# EAGLE design relay-set-d-decode (EAGLE 7.3.0)
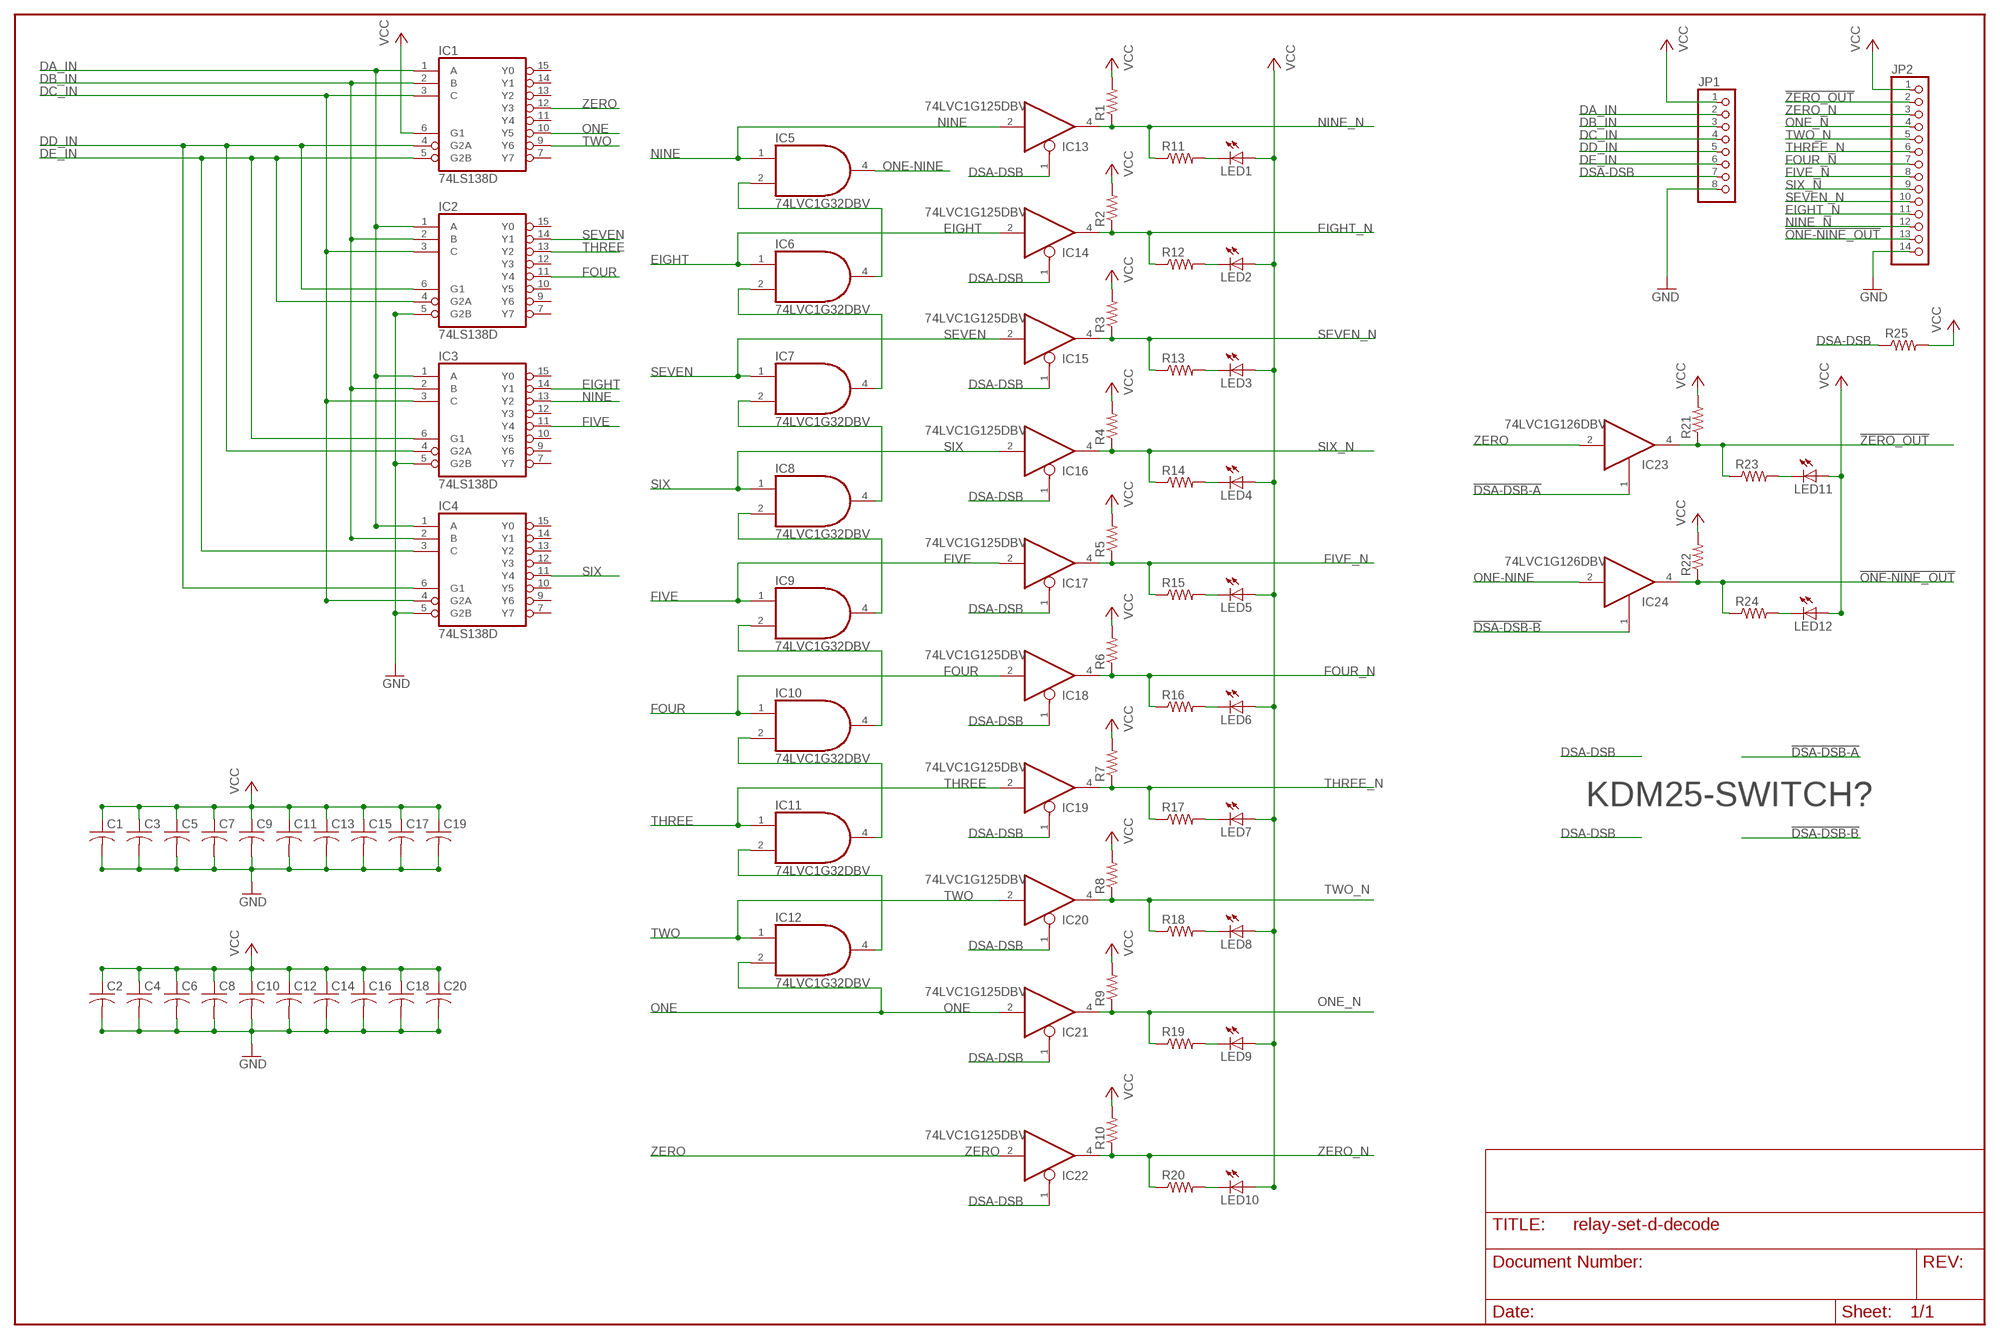
[diagram p0: schematic, sheet 1]

## Parts
C1  C-USC0805  [C0805]
C2  C-USC0805  [C0805]
C3  C-USC0805  [C0805]
C4  C-USC0805  [C0805]
C5  C-USC0805  [C0805]
C6  C-USC0805  [C0805]
C7  C-USC0805  [C0805]
C8  C-USC0805  [C0805]
C9  C-USC0805  [C0805]
C10  C-USC0805  [C0805]
C11  C-USC0805  [C0805]
C12  C-USC0805  [C0805]
C13  C-USC0805  [C0805]
C14  C-USC0805  [C0805]
C15  C-USC0805  [C0805]
C16  C-USC0805  [C0805]
C17  C-USC0805  [C0805]
C18  C-USC0805  [C0805]
C19  C-USC0805  [C0805]
C20  C-USC0805  [C0805]
IC1  74LS138D  [SO16]
IC2  74LS138D  [SO16]
IC3  74LS138D  [SO16]
IC4  74LS138D  [SO16]
IC5  74LVC1G32DBV  74LVC1G08DBV  [SOT23-5]
IC6  74LVC1G32DBV  74LVC1G08DBV  [SOT23-5]
IC7  74LVC1G32DBV  74LVC1G08DBV  [SOT23-5]
IC8  74LVC1G32DBV  74LVC1G08DBV  [SOT23-5]
IC9  74LVC1G32DBV  74LVC1G08DBV  [SOT23-5]
IC10  74LVC1G32DBV  74LVC1G08DBV  [SOT23-5]
IC11  74LVC1G32DBV  74LVC1G08DBV  [SOT23-5]
IC12  74LVC1G32DBV  74LVC1G08DBV  [SOT23-5]
IC13  74LVC1G125DBV  [SOT23-5]
IC14  74LVC1G125DBV  [SOT23-5]
IC15  74LVC1G125DBV  [SOT23-5]
IC16  74LVC1G125DBV  [SOT23-5]
IC17  74LVC1G125DBV  [SOT23-5]
IC18  74LVC1G125DBV  [SOT23-5]
IC19  74LVC1G125DBV  [SOT23-5]
IC20  74LVC1G125DBV  [SOT23-5]
IC21  74LVC1G125DBV  [SOT23-5]
IC22  74LVC1G125DBV  [SOT23-5]
IC23  74LVC1G126DBV  [SOT23-5]
IC24  74LVC1G126DBV  [SOT23-5]
JP1  PINHD-1X8  [1X08]
JP2  PINHD-1X14  [1X14]
LED1  LEDCHIP-LED0805  [CHIP-LED0805]
LED2  LEDCHIP-LED0805  [CHIP-LED0805]
LED3  LEDCHIP-LED0805  [CHIP-LED0805]
LED4  LEDCHIP-LED0805  [CHIP-LED0805]
LED5  LEDCHIP-LED0805  [CHIP-LED0805]
LED6  LEDCHIP-LED0805  [CHIP-LED0805]
LED7  LEDCHIP-LED0805  [CHIP-LED0805]
LED8  LEDCHIP-LED0805  [CHIP-LED0805]
LED9  LEDCHIP-LED0805  [CHIP-LED0805]
LED10  LEDCHIP-LED0805  [CHIP-LED0805]
LED11  LEDCHIP-LED0805  [CHIP-LED0805]
LED12  LEDCHIP-LED0805  [CHIP-LED0805]
R1  R-US_R0805  [R0805]
R2  R-US_R0805  [R0805]
R3  R-US_R0805  [R0805]
R4  R-US_R0805  [R0805]
R5  R-US_R0805  [R0805]
R6  R-US_R0805  [R0805]
R7  R-US_R0805  [R0805]
R8  R-US_R0805  [R0805]
R9  R-US_R0805  [R0805]
R10  R-US_R0805  [R0805]
R11  R-US_R0805  [R0805]
R12  R-US_R0805  [R0805]
R13  R-US_R0805  [R0805]
R14  R-US_R0805  [R0805]
R15  R-US_R0805  [R0805]
R16  R-US_R0805  [R0805]
R17  R-US_R0805  [R0805]
R18  R-US_R0805  [R0805]
R19  R-US_R0805  [R0805]
R20  R-US_R0805  [R0805]
R21  R-US_R0805  [R0805]
R22  R-US_R0805  [R0805]
R23  R-US_R0805  [R0805]
R24  R-US_R0805  [R0805]
R25  R-US_R0805  [R0805]

## Nets
!DSA-DSB-A: IC23.1(OE)
!DSA-DSB-B: IC24.1(OE)
!ONE-NINE_OUT: IC24.4(O) JP2.13 R22.1 R24.1
!ZERO_OUT: IC23.4(O) JP2.2 R21.1 R23.1
DA_IN: IC1.1(A) IC2.1(A) IC3.1(A) IC4.1(A) JP1.2
DB_IN: IC1.2(B) IC2.2(B) IC3.2(B) IC4.2(B) JP1.3
DC_IN: IC1.3(C) IC2.3(C) IC3.3(C) IC4.4(G2A) JP1.4
DD_IN: IC1.4(G2A) IC2.6(G1) IC3.4(G2A) IC4.6(G1) JP1.5
DE_IN: IC1.5(G2B) IC2.4(G2A) IC3.6(G1) IC4.3(C) JP1.6
DSA-DSB: IC13.1(OE) IC14.1(OE) IC15.1(OE) IC16.1(OE) IC17.1(OE) IC18.1(OE) IC19.1(OE) IC20.1(OE) IC21.1(OE) IC22.1(OE) JP1.7 R25.1
EIGHT: IC3.14(Y1) IC6.1(I0) IC14.2(I)
EIGHT_N: IC14.4(O) JP2.11 R2.1 R12.1
FIVE: IC3.11(Y4) IC9.1(I0) IC17.2(I)
FIVE_N: IC17.4(O) JP2.8 R5.1 R15.1
FOUR: IC2.11(Y4) IC10.1(I0) IC18.2(I)
FOUR_N: IC18.4(O) JP2.7 R6.1 R16.1
GND: C1.2 C2.2 C3.2 C4.2 C5.2 C6.2 C7.2 C8.2 C9.2 C10.2 C11.2 C12.2 C13.2 C14.2 C15.2 C16.2 C17.2 C18.2 C19.2 C20.2 IC2.5(G2B) IC3.5(G2B) IC4.5(G2B) JP1.8 JP2.14
N$1: LED1.C R11.2
N$2: LED2.C R12.2
N$3: LED3.C R13.2
N$4: LED4.C R14.2
N$5: LED5.C R15.2
N$6: LED6.C R16.2
N$7: LED7.C R17.2
N$8: LED8.C R18.2
N$9: LED9.C R19.2
N$10: LED10.C R20.2
N$11: IC8.2(I1) IC9.4(O)
N$12: IC9.2(I1) IC10.4(O)
N$13: IC10.2(I1) IC11.4(O)
N$14: IC11.2(I1) IC12.4(O)
N$15: LED11.C R23.2
N$17: IC5.2(I1) IC6.4(O)
N$18: IC6.2(I1) IC7.4(O)
N$19: IC7.2(I1) IC8.4(O)
N$20: LED12.C R24.2
NINE: IC3.13(Y2) IC5.1(I0) IC13.2(I)
NINE_N: IC13.4(O) JP2.12 R1.1 R11.1
ONE: IC1.10(Y5) IC12.2(I1) IC21.2(I)
ONE-NINE: IC5.4(O) IC24.2(I)
ONE_N: IC21.4(O) JP2.4 R9.1 R19.1
SEVEN: IC2.14(Y1) IC7.1(I0) IC15.2(I)
SEVEN_N: IC15.4(O) JP2.10 R3.1 R13.1
SIX: IC4.11(Y4) IC8.1(I0) IC16.2(I)
SIX_N: IC16.4(O) JP2.9 R4.1 R14.1
THREE: IC2.13(Y2) IC11.1(I0) IC19.2(I)
THREE_N: IC19.4(O) JP2.6 R7.1 R17.1
TWO: IC1.9(Y6) IC12.1(I0) IC20.2(I)
TWO_N: IC20.4(O) JP2.5 R8.1 R18.1
VCC: C1.1 C2.1 C3.1 C4.1 C5.1 C6.1 C7.1 C8.1 C9.1 C10.1 C11.1 C12.1 C13.1 C14.1 C15.1 C16.1 C17.1 C18.1 C19.1 C20.1 IC1.6(G1) JP1.1 JP2.1 LED1.A LED2.A LED3.A LED4.A LED5.A LED6.A LED7.A LED8.A LED9.A LED10.A LED11.A LED12.A R1.2 R2.2 R3.2 R4.2 R5.2 R6.2 R7.2 R8.2 R9.2 R10.2 R21.2 R22.2 R25.2
ZERO: IC1.12(Y3) IC22.2(I) IC23.2(I)
ZERO_N: IC22.4(O) JP2.3 R10.1 R20.1
Unconnected: IC1.7(Y7) IC1.11(Y4) IC1.13(Y2) IC1.14(Y1) IC1.15(Y0) IC2.7(Y7) IC2.9(Y6) IC2.10(Y5) IC2.12(Y3) IC2.15(Y0) IC3.7(Y7) IC3.9(Y6) IC3.10(Y5) IC3.12(Y3) IC3.15(Y0) IC4.7(Y7) IC4.9(Y6) IC4.10(Y5) IC4.12(Y3) IC4.13(Y2) IC4.14(Y1) IC4.15(Y0)

## Notes on the sheet
- KDM25-SWITCH?

## Power pins joined to a net without a drawn wire
GND: IC1.8(GND) IC2.8(GND) IC3.8(GND) IC4.8(GND) IC5.3(GND) IC6.3(GND) IC7.3(GND) IC8.3(GND) IC9.3(GND) IC10.3(GND) IC11.3(GND) IC12.3(GND) IC13.3(GND) IC14.3(GND) IC15.3(GND) IC16.3(GND) IC17.3(GND) IC18.3(GND) IC19.3(GND) IC20.3(GND) IC21.3(GND) IC22.3(GND) IC23.3(GND) IC24.3(GND)
VCC: IC1.16(VCC) IC2.16(VCC) IC3.16(VCC) IC4.16(VCC) IC5.5(VCC) IC6.5(VCC) IC7.5(VCC) IC8.5(VCC) IC9.5(VCC) IC10.5(VCC) IC11.5(VCC) IC12.5(VCC) IC13.5(VCC) IC14.5(VCC) IC15.5(VCC) IC16.5(VCC) IC17.5(VCC) IC18.5(VCC) IC19.5(VCC) IC20.5(VCC) IC21.5(VCC) IC22.5(VCC) IC23.5(VCC) IC24.5(VCC)

## Library data of the parts
C1-C20 = resistor:C-US: CAPACITOR, American symbol
IC1-IC4 = 74xx-us:74*138: 3-line to 8-line DECODER/DEMULTIPLEXER
IC5-IC12 = 74xx-little-us:74*1G08: 2-input AND gate
IC13-IC22 = 74xx-little-us:74*1G125: Single Bus Buffer Gate with 3-State Output
IC23 IC24 = 74xx-little-us:74*1G126: Single Bus Buffer Gate With 3-State Outputs
JP1 = pinhead:PINHD-1X8: PIN HEADER
JP2 = pinhead:PINHD-1X14: PIN HEADER
LED1-LED12 = led:LED: LED OSRAM: - CHIPLED LG R971, LG N971, LY N971, LG Q971, LY Q971, LO R971, LY R971 LH N974, LH R974 LS Q976, LO Q976, LY Q976 LO Q996 - Hyper CHIPLED LW Q18S LB Q993, LB Q99A, LB R99A - SideLED LS A670, LO A670, LY A670, LG A670, LP A670 LB A673, LV A673, LT A673, LW A673 LH A674 LY A675 LS A676, LA A676, LO A676, LY A676, LW A676 LS A679, LY A679, LG A679 - Hyper Micro SIDELED® LS Y876, LA Y876, LO Y876, LY Y876 LT Y87S - SmartLED LW L88C, LW L88S LB L89C, LB L89S, LG L890 LS L89K, LO L89K, LY L89K LS L896, LA L896, LO L896, LY L896 - TOPLED LS T670, LO T670, LY T670, LG T670, LP T670 LSG T670, LSP T670, LSY T670, LOP T670, LYG T670 LG T671, LOG T671, LSG T671 LB T673, LV T673, LT T673, LW T673 LH T674 LS T676, LA T676, LO T676, LY T676, LB T676, LH T676, LSB T676, LW T676 LB T67C, LV T67C, LT T67C, LS T67K, LO T67K, LY T67K, LW E67C LS E67B, LA E67B, LO E67B, LY E67B, LB E67C, LV E67C, LT E67C LW T67C LS T679, LY T679, LG T679 LS T770, LO T770, LY T770, LG T770, LP T770 LB T773, LV T773, LT T773, LW T773 LH T774 LS E675, LA E675, LY E675, LS T675 LS T776, LA T776, LO T776, LY T776, LB T776 LHGB T686 LT T68C, LB T68C - Hyper Mini TOPLED® LB M676 - Mini TOPLED Santana® LG M470 LS M47K, LO M47K, LY M47K Source: http://www.osram.convergy.de LUXEON: - LUMILED® LXK2-PW12-R00, LXK2-PW12-S00, LXK2-PW14-U00, LXK2-PW14-V00 LXK2-PM12-R00, LXK2-PM12-S00, LXK2-PM14-U00 LXK2-PE12-Q00, LXK2-PE12-R00, LXK2-PE12-S00, LXK2-PE14-T00, LXK2-PE14-U00 LXK2-PB12-K00, LXK2-PB12-L00, LXK2-PB12-M00, LXK2-PB14-N00, LXK2-PB14-P00, LXK2-PB14-Q00 LXK2-PR12-L00, LXK2-PR12-M00, LXK2-PR14-Q00, LXK2-PR14-R00 LXK2-PD12-Q00, LXK2-PD12-R00, LXK2-PD12-S00 LXK2-PH12-R00, LXK2-PH12-S00 LXK2-PL12-P00, LXK2-PL12-Q00, LXK2-PL12-R00 Source: www.luxeon.com KINGBRIGHT: KA-3528ASYC Source: www.kingbright.com
R1-R25 = resistor:R-US_: RESISTOR, American symbol

## Board
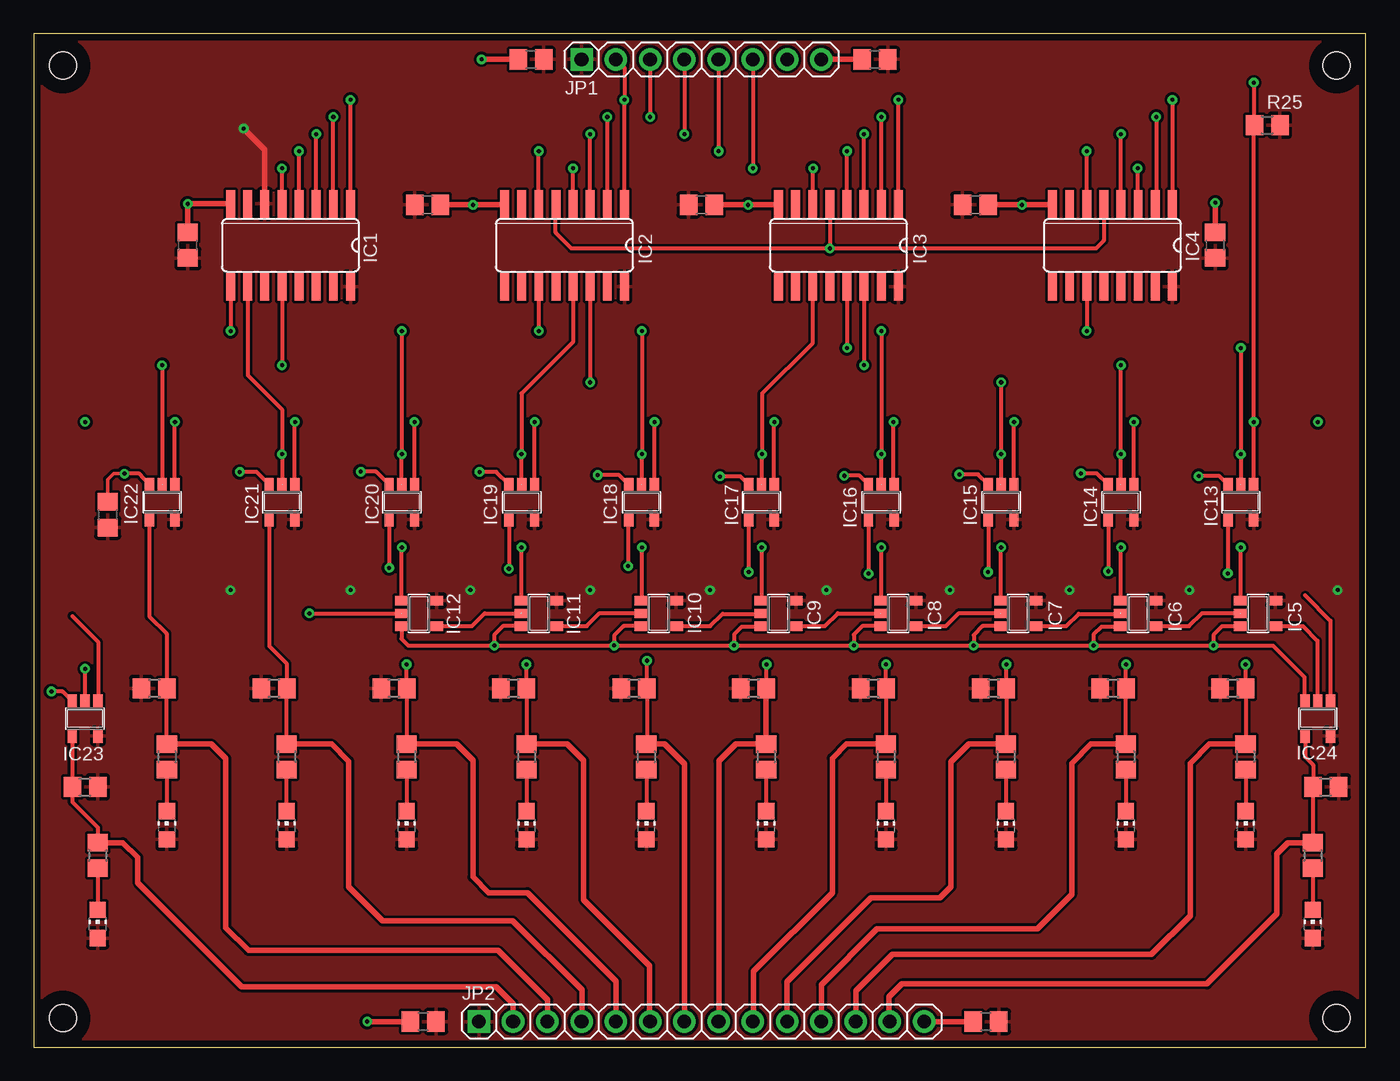
[diagram p1: board, top side]
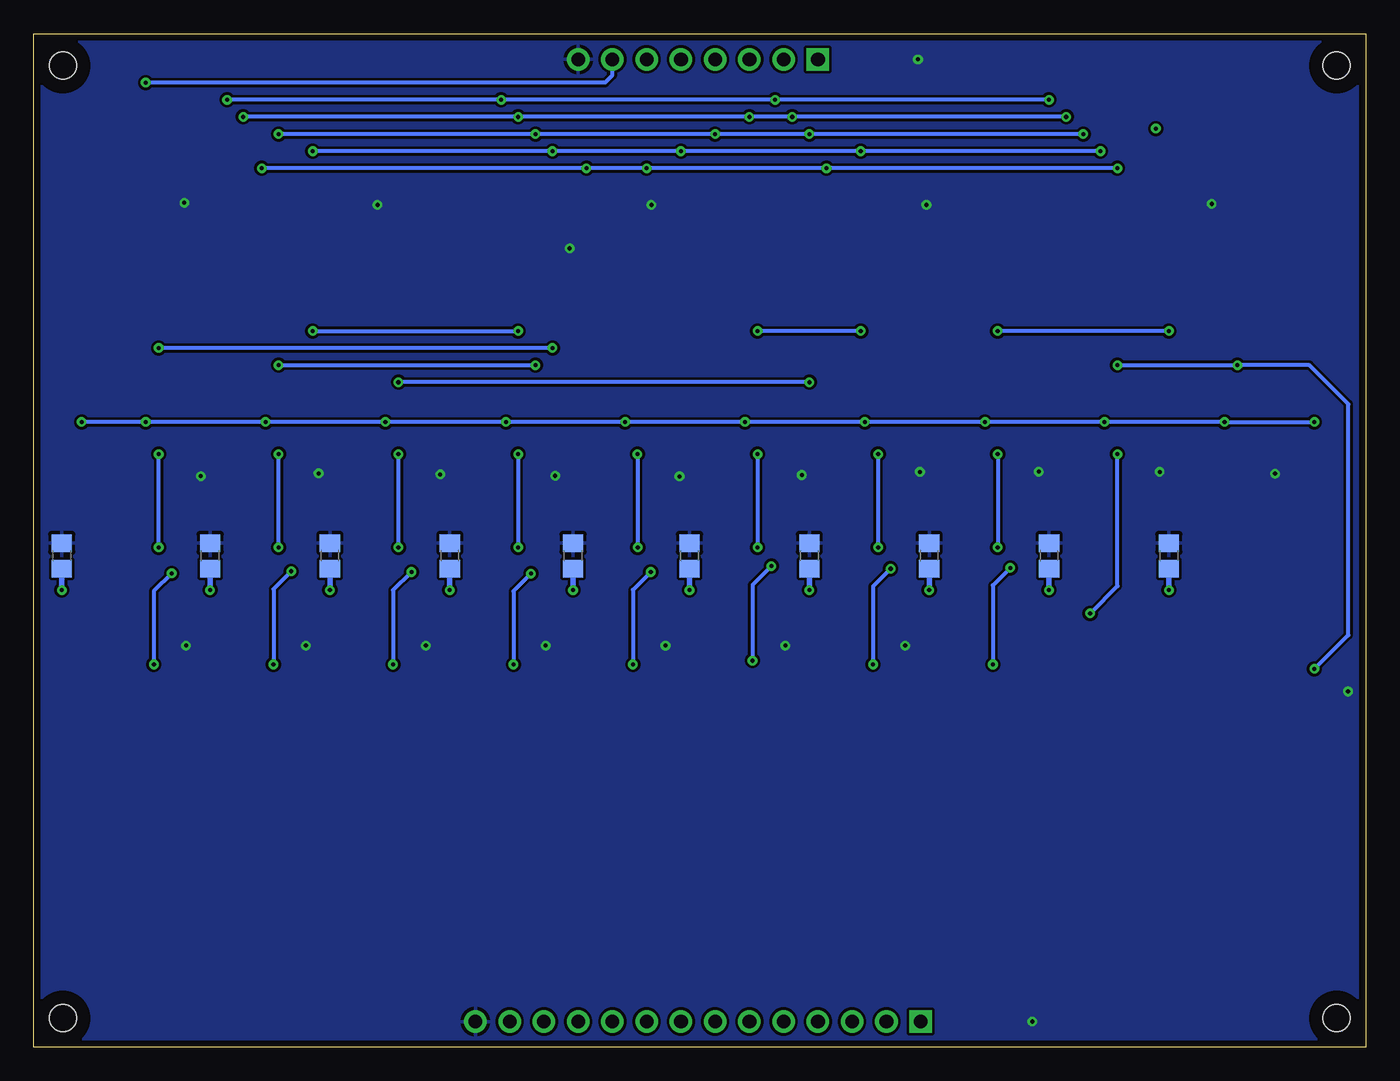
[diagram p2: board, bottom side, seen from below]

Size 98.81 x 75.18 mm. Coordinates in mm from the lower left corner, seen from the top.
Outline: 98.81,75.18 0,75.18 0,0 98.81,0 98.81,75.18
Copper layers (1*16): Top 0.035mm / dielectric 1.5mm / Bottom 0.035mm
Design rules "default *": minimum track width 8mil, minimum drill 12mil, track to track 8mil, track to pad 10mil, pad to pad 10mil, via to via 8mil, smd to smd 8mil, copper to edge 20mil, drill to drill 8mil, minimum pad ring 10mil, minimum via ring 8mil, stop-mask expansion 4mil, vias tented up to drill 0mil, thermal gap 10mil
Holes 2.01 mm at 2.16,2.16 96.65,2.16 96.65,72.82 2.16,72.82
tRestrict: area 94.6,0.2 to 98.7,4.2; area 94.6,70.8 to 98.7,74.8; area 0.2,70.8 to 4.2,74.8; area 0.2,0.2 to 4.2,4.2
bRestrict: area 94.6,0.2 to 98.7,4.2; area 94.6,70.8 to 98.7,74.8; area 0.2,70.8 to 4.2,74.8; area 0.2,0.2 to 4.2,4.2

### Footprints (pad centres in the part's own frame; a part is rotated, then mirrored left to right if it is on the bottom)
C0805 = smd 1.3 x 1.5: 1 -0.95,0; 2 0.95,0
SO16 = smd 0.66 x 2.032: 1 -4.445,-3.073; 2 -3.175,-3.073; 3 -1.905,-3.073; 4 -0.635,-3.073; 5 0.635,-3.073; 6 1.905,-3.073; 7 3.175,-3.073; 8 4.445,-3.073; 9 4.445,3.073; 10 3.175,3.073; 11 1.905,3.073; 12 0.635,3.073; 13 -0.635,3.073; 14 -1.905,3.073; 15 -3.175,3.073; 16 -4.445,3.073
SOT23-5 = smd 0.69 x 0.99: 1 -0.95,-1.29; 2 0,-1.29; 3 0.95,-1.29; 4 0.95,1.3; 5 -0.95,1.3
1X08 = drill 1.016 pad 1.676 square: 1 -8.89,0 | drill 1.016 pad 1.676: 2 -6.35,0; 3 -3.81,0; 4 -1.27,0; 5 1.27,0; 6 3.81,0; 7 6.35,0; 8 8.89,0
1X14 = drill 1.016 pad 1.676 square: 1 -16.51,0 | drill 1.016 pad 1.676: 2 -13.97,0; 3 -11.43,0; 4 -8.89,0; 5 -6.35,0; 6 -3.81,0; 7 -1.27,0; 8 1.27,0; 9 3.81,0; 10 6.35,0; 11 8.89,0; 12 11.43,0; 13 13.97,0; 14 16.51,0
CHIP-LED0805 = smd 1.2 x 1.2: A 0,-1.05; C 0,1.05
R0805 = smd 1.3 x 1.5: 1 -0.95,0; 2 0.95,0

### Placement (x,y rotation side)
C1  29.21,62.48 0 top
C2  87.63,59.49 90 top
C3  49.53,62.48 0 top
C4  69.85,62.48 0 top
C5  36.88,73.28 180 top
C6  50.16,36.45 90 bottom
C7  62.41,73.28 180 top
C8  58.8,36.45 90 bottom
C9  28.88,1.91 180 top
C10  67.94,36.45 90 bottom
C11  70.64,1.91 180 top
C12  76.83,36.45 90 bottom
C13  5.49,39.5 90 top
C14  85.72,36.45 90 bottom
C15  14.61,36.45 90 bottom
C16  96.72,36.45 90 bottom
C17  23.5,36.45 90 bottom
C18  32.38,36.45 90 bottom
C19  11.43,59.49 90 top
C20  41.27,36.45 90 bottom
IC1  19.05,59.49 180 top
IC2  39.37,59.49 180 top
IC3  59.69,59.49 180 top
IC4  80.01,59.49 180 top
IC5  90.81,32.18 270 top
IC6  81.92,32.18 270 top
IC7  73.03,32.18 270 top
IC8  64.14,32.18 270 top
IC9  55.24,32.18 270 top
IC10  46.35,32.18 270 top
IC11  37.47,32.18 270 top
IC12  28.57,32.18 270 top
IC13  89.53,40.44 180 top
IC14  80.64,40.44 180 top
IC15  71.75,40.44 180 top
IC16  62.87,40.44 180 top
IC17  53.98,40.44 180 top
IC18  45.09,40.44 180 top
IC19  36.2,40.44 180 top
IC20  27.3,40.44 180 top
IC21  18.41,40.44 180 top
IC22  9.53,40.44 180 top
IC23  3.81,24.38 180 top
IC24  95.25,24.38 180 top
JP1  49.53,73.28 0 top
JP2  49.53,1.91 0 top
LED1  89.89,16.46 0 top
LED2  81,16.46 0 top
LED3  72.11,16.46 0 top
LED4  63.22,16.46 0 top
LED5  54.33,16.46 0 top
LED6  45.44,16.46 0 top
LED7  36.55,16.46 0 top
LED8  27.66,16.46 0 top
LED9  18.77,16.46 0 top
LED10  9.88,16.46 0 top
LED11  4.75,9.14 0 top
LED12  94.87,9.14 0 top
R1  88.95,26.62 180 top
R2  80.06,26.62 180 top
R3  71.2,26.62 180 top
R4  62.28,26.62 180 top
R5  53.39,26.62 180 top
R6  44.53,26.62 180 top
R7  35.59,26.62 180 top
R8  26.72,26.62 180 top
R9  17.83,26.62 180 top
R10  8.94,26.62 180 top
R11  89.89,21.54 270 top
R12  81,21.54 270 top
R13  72.11,21.54 270 top
R14  63.22,21.54 270 top
R15  54.33,21.54 270 top
R16  45.44,21.54 270 top
R17  36.55,21.54 270 top
R18  27.66,21.54 270 top
R19  18.77,21.54 270 top
R20  9.88,21.54 270 top
R21  3.81,19.3 0 top
R22  95.83,19.3 0 top
R23  4.75,14.22 270 top
R24  94.87,14.22 270 top
R25  91.49,68.4 0 top

### Tracks (layer width: path | path; a pad name or v marks a point on that pad's centre or on a via)
!DSA-DSB-A
  Top 0.305: 2.86,31.99 4.78,30.07 4.78,25.69 IC23.1
!DSA-DSB-B
  Top 0.305: 94.3,33.51 96.19,31.62 96.19,25.68 IC24.1
!ONE-NINE_OUT
  Top 0.305: R24.1 94.88,15.19 R22.1 94.89,19.31 94.89,20.93 94.3,21.52 IC24.4
  Top 0.406: R24.1 93.03,15.17 92.2,14.35 92.2,9.88 87.02,4.7 64.39,4.7 63.45,3.76 63.45,1.96 JP2.13
!ZERO_OUT
  Top 0.305: IC23.4 R21.1 2.86,18.2 4.75,16.31 R23.1
  Top 0.406: JP2.2 35.56,3.23 34.29,4.5 15.43,4.5 7.72,12.2 7.72,14.07 6.62,15.17 R23.1
DA_IN  (via drill 0.3)
  Top 0.305: IC1.1 v23.5,70.28 | v84.45,70.28 IC4.1 | IC2.1 v43.81,70.28 43.81,72.64 JP1.2 | IC3.1 v64.14,70.28
  Bottom 0.305: v23.5,70.28 v43.81,70.28 v64.14,70.28 v84.45,70.28
DB_IN  (via drill 0.3)
  Top 0.305: IC1.2 v22.23,69.01 | v83.26,69.01 83.26,62.56 IC4.2 | IC2.2 v42.55,69.01 | IC3.2 v62.87,69.01 | JP1.3 v45.72,69.01
  Bottom 0.305: v22.23,69.01 v42.55,69.01 v45.72,69.01 v62.87,69.01 v83.26,69.01
DC_IN  (via drill 0.3)
  Top 0.305: IC1.3 v20.95,67.74 | IC3.3 v61.59,67.74 | JP1.4 v48.26,67.74 | IC4.4 v80.64,67.74 | IC2.3 v41.27,67.74
  Bottom 0.305: v20.95,67.74 v41.27,67.74 v48.26,67.74 v61.59,67.74 v80.64,67.74
DD_IN  (via drill 0.3)
  Top 0.305: IC1.4 v19.68,66.47 | IC2.6 v37.47,66.47 | JP1.5 v50.8,66.47 | IC4.6 v78.11,66.47 | IC3.4 v60.33,66.47
  Bottom 0.305: v19.68,66.47 v37.47,66.47 v50.8,66.47 v60.33,66.47 v78.11,66.47
DE_IN  (via drill 0.3)
  Top 0.305: IC1.5 v18.41,65.2 | IC2.4 v40.01,65.2 | IC3.6 57.78,65.18 v57.81,65.2 | JP1.6 v53.34,65.2 | IC4.3 81.89,62.59 v81.89,65.2
  Bottom 0.305: v18.41,65.2 v40.01,65.2 v53.34,65.2 v57.81,65.2 v81.89,65.2
DSA-DSB  (via drill 0.3)
  Top 0.305: IC22.1 v10.47,46.38 | 90.5,41.73 IC13.1 90.48,46.37 v90.5,46.38 90.5,68.36 R25.1 90.5,68.44 v90.5,71.55 | IC21.1 19.36,46.38 v19.38,46.38 | IC20.1 28.25,46.38 v28.25,46.38 | IC19.1 37.15,46.38 v37.16,46.38 | IC18.1 46.03,46.37 v46.05,46.38 | IC17.1 54.92,46.37 v54.94,46.38 | IC16.1 63.78,41.76 v63.78,46.38 | IC15.1 72.7,46.38 v72.72,46.38 | IC14.1 81.59,46.38 v81.61,46.38
  Bottom 0.305: v90.5,71.55 56.44,71.55 55.88,72.11 JP1.7 | v3.81,46.38 v10.47,46.38 v19.38,46.38 v28.25,46.38 v37.16,46.38 v46.05,46.38 v54.94,46.38 v63.78,46.38 v72.72,46.38 81.59,46.38 v81.61,46.38 v90.5,46.38 v95.25,46.38
EIGHT  (via drill 0.3)
  Top 0.305: IC3.14 v61.59,50.6 | IC14.2 v80.64,43.99 v80.64,50.6 | IC6.1 80.64,33.15 v80.64,37.08
  Bottom 0.305: v80.64,50.6 v61.59,50.6 | v80.64,37.08 v80.64,43.99
EIGHT_N  (via drill 0.3)
  Top 0.305: 81.54,22.5 R12.1 R2.1 81.03,26.63 v81.03,28.4 | IC14.4 79.69,35.32 v79.7,35.31
  Top 0.406: R12.1 78.42,22.49 76.99,21.06 76.99,11.33 74.45,8.79 62.56,8.79 58.42,4.65 JP2.11
  Bottom 0.305: v79.7,35.31 81.03,33.98 v81.03,28.4
FIVE  (via drill 0.3)
  Top 0.305: IC17.2 54.03,41.78 v54.03,43.99 54.03,48.49 57.78,52.25 IC3.11 57.76,56.39 | IC9.1 54,33.18 v54,37.08
  Bottom 0.305: v54.03,43.99 54,43.38 v54,37.08
FIVE_N  (via drill 0.3)
  Top 0.305: IC17.4 53.02,35.27 v53.03,35.26 | R5.1 54.36,26.63 v54.36,28.4
  Top 0.406: R5.1 R15.1 52.08,22.49 50.83,21.23 50.83,1.93 JP2.8
  Bottom 0.305: v53.03,35.26 54.36,33.93 v54.36,28.4
FOUR  (via drill 0.3)
  Top 0.305: IC2.11 v37.47,53.14 | v45.11,53.14 v45.11,43.99 45.11,41.73 IC18.2 | IC10.1 45.11,33.18 v45.11,37.08
  Bottom 0.305: v37.47,53.14 v45.11,53.14 | v45.11,43.99 v45.11,37.08
FOUR_N  (via drill 0.3)
  Top 0.305: R16.1 45.48,22.52 R6.1 45.49,26.63 v45.49,28.68 | v44.09,35.69 44.13,35.73 IC18.4
  Top 0.406: R16.1 46.8,22.49 48.26,21.03 JP2.7
  Bottom 0.305: v44.09,35.69 45.49,34.29 v45.49,28.68
GND  (via drill 0.3)
  Top 0.254: v6.73,42.55 5.92,42.55 5.49,42.11 C13.2
  Top 0.305: IC21.3 16.52,42.67 v15.29,42.67 | IC20.3 25.38,42.7 v24.26,42.7 | IC23.3 2.14,26.39 v1.32,26.39 | IC22.3 7.83,42.55 v6.73,42.55 | v34.16,29.79 27.79,29.79 27.29,30.3 IC12.3 | v34.16,29.79 v43.05,29.79 | v43.05,29.79 v51.94,29.79 | v51.94,29.79 v60.83,29.79 | v60.83,29.79 v69.72,29.79 | v69.72,29.79 v78.61,29.79 | 89.52,31.17 IC5.3 89.5,31.22 88.14,31.22 87.5,30.58 v87.5,29.79 | IC6.3 80.67,31.19 79.19,31.19 78.61,30.61 v78.61,29.79 | IC9.3 53.9,31.18 52.51,31.18 51.94,30.61 v51.94,29.79 | 45.21,31.09 IC10.3 43.75,31.23 43.05,30.53 v43.05,29.79 | IC11.3 34.81,31.23 34.16,30.58 v34.16,29.79 | IC8.3 61.46,31.23 60.83,30.61 v60.83,29.79 | IC7.3 70.37,31.23 69.72,30.58 v69.72,29.79 | v78.61,29.79 v87.5,29.79 | v87.5,29.79 91.92,29.79 94.26,27.46 94.26,25.71 IC24.3 | IC19.3 34.3,42.67 v33.07,42.67 | IC18.3 43.42,42.44 v41.83,42.44 | IC17.3 52.41,42.34 v50.9,42.34 | IC16.3 61.25,42.39 v60.12,42.39 | IC15.3 70.04,42.49 v68.66,42.49 | IC14.3 78.85,42.57 v77.67,42.57 | IC13.3 87.94,42.37 v86.41,42.37 | IC4.5 79.38,59.84 78.79,59.26 v59.05,59.26 | v59.05,59.26 39.88,59.26 38.71,60.43 38.71,62.53 IC2.5 | IC3.5 v59.05,59.26
  Top 0.406: IC1.8 v11.43,62.56 C19.2 | C1.2 v32.59,62.48 34.92,62.48 IC2.8 | C3.2 v52.98,62.48 55.24,62.48 IC3.8 | C4.2 v73.3,62.48 75.56,62.48 IC4.8 | C2.2 v87.63,62.64 | C5.2 v33.22,73.28 | C7.2 JP1.8 | C11.2 JP2.14 | C9.2 v24.74,1.91
  Bottom 0.305: v68.66,42.49 68.56,42.6
  pour Bottom: 98.55,0.25 0.25,0.25 0.25,74.93 98.55,74.93
N$1
  Top 0.305: R11.2 LED1.C
N$2
  Top 0.305: R12.2 LED2.C
N$3
  Top 0.305: R13.2 LED3.C
N$4
  Top 0.305: R14.2 LED4.C
N$5
  Top 0.305: R15.2 LED5.C
N$6
  Top 0.305: R16.2 LED6.C
N$7
  Top 0.305: R17.2 LED7.C
N$8
  Top 0.305: R18.2 LED8.C
N$9
  Top 0.305: LED9.C R19.2
N$10
  Top 0.305: R20.2 LED10.C
N$11
  Top 0.305: IC9.4 58.69,31.23 59.64,32.18 IC8.2
N$12
  Top 0.305: IC10.4 50.18,31.23 51.1,32.16 53.93,32.16 IC9.2
N$13
  Top 0.305: IC11.4 41.01,31.23 41.99,32.21 45.04,32.21 IC10.2
N$14
  Top 0.305: IC12.4 32.5,31.23 33.45,32.18 IC11.2
N$15
  Top 0.305: R23.2 LED11.C
N$17
  Top 0.305: IC6.4 85.69,31.23 86.67,32.21 89.49,32.21 IC5.2
N$18
  Top 0.305: IC7.4 76.6,31.23 77.52,32.16 80.6,32.16 IC6.2
N$19
  Top 0.305: IC8.4 67.66,31.23 68.63,32.21 71.71,32.21 IC7.2
N$20
  Top 0.305: R24.2 LED12.C
NINE  (via drill 0.3)
  Top 0.305: IC3.13 v60.33,51.87 | v89.53,51.87 v89.53,43.99 IC13.2 | IC5.1 89.53,33.15 v89.53,37.08
  Bottom 0.305: v60.33,51.87 v89.53,51.87 | v89.53,37.08 v89.53,43.99
NINE_N  (via drill 0.3)
  Top 0.305: R11.1 R1.1 v89.89,28.4 | IC13.4 88.58,35.17 v88.57,35.15
  Top 0.406: R11.1 87.21,22.49 85.78,21.06 85.78,9.75 82.91,6.88 63.68,6.88 60.98,4.19 60.98,1.93 JP2.12
  Bottom 0.305: v88.57,35.15 89.89,33.83 v89.89,28.4
ONE  (via drill 0.3)
  Top 0.305: IC1.10 15.88,49.86 18.41,47.32 v18.41,43.99 IC21.2 | v20.45,32.18 IC12.2
  Bottom 0.305: v18.41,43.99 18.41,34.21 v20.45,32.18
ONE-NINE
  Top 0.305: IC5.4 94.14,31.23 95.22,30.15 95.22,25.7 IC24.2
ONE_N
  Top 0.305: IC21.4 17.46,29.75 18.75,28.47 18.75,26.66 R9.1 R19.1
  Top 0.406: R19.1 22.09,22.49 23.37,21.21 23.37,11.89 25.88,9.37 35.53,9.37 40.66,4.24 40.66,1.93 JP2.4
SEVEN  (via drill 0.3)
  Top 0.305: IC2.14 v41.27,49.33 | v71.75,49.33 v71.75,43.99 IC15.2 | IC7.1 71.75,33.15 v71.75,37.08
  Bottom 0.305: v41.27,49.33 v71.75,49.33 | v71.75,37.08 v71.75,43.99
SEVEN_N  (via drill 0.3)
  Top 0.305: R13.1 72.15,22.52 R3.1 72.16,26.63 v72.16,28.4 | IC15.4 70.81,35.27 v70.79,35.26
  Top 0.406: R13.1 69.35,22.49 68.05,21.18 68.05,11.91 67.23,11.1 62.1,11.1 55.85,4.85 55.85,1.93 JP2.10
  Bottom 0.305: v72.16,28.4 72.16,33.91 72.13,33.91 v70.79,35.26
SIX  (via drill 0.3)
  Top 0.305: v62.87,53.14 v62.87,43.99 IC16.2 | IC4.11 v78.11,53.14 | IC8.1 62.87,33.15 v62.87,37.08
  Bottom 0.305: v78.11,53.14 v62.87,53.14 | v62.87,43.99 v62.87,37.08
SIX_N  (via drill 0.3)
  Top 0.305: R14.1 63.23,22.5 R4.1 v63.22,28.4 | IC16.4 61.91,35.14 v61.92,35.13
  Top 0.406: R14.1 60.28,22.49 59.23,21.44 59.23,11.46 53.39,5.61 53.39,1.96 JP2.9
  Bottom 0.305: v61.92,35.13 63.22,33.83 v63.22,28.4
THREE  (via drill 0.3)
  Top 0.305: 36.17,41.75 IC19.2 arc-90 36.17,41.75 | 36.17,41.75 v36.17,43.99 36.17,48.49 40.03,52.35 40.03,56.39 IC2.13 | IC11.1 v36.17,37.08
  Bottom 0.305: v36.17,43.99 v36.17,37.08
THREE_N  (via drill 0.3)
  Top 0.305: 36.55,26.63 R7.1 | 36.55,26.63 R17.1 | 36.55,26.63 v36.55,28.4 | IC19.4 v35.24,35.49
  Top 0.406: R17.1 39.56,22.49 40.79,21.26 40.79,10.95 45.7,6.04 45.7,1.93 JP2.6
  Bottom 0.305: v36.55,28.4 36.55,34.19 v35.24,35.49
TWO  (via drill 0.3)
  Top 0.305: IC1.9 v14.61,53.14 | v27.3,53.14 v27.3,43.99 IC20.2 | IC12.1 27.3,33.15 v27.3,37.08
  Bottom 0.305: v14.61,53.14 v27.3,53.14 | v27.3,43.99 v27.3,37.08
TWO_N  (via drill 0.3)
  Top 0.305: R8.1 R18.1 | R8.1 | R8.1 v27.66,28.4 | IC20.4 v26.36,35.56
  Top 0.406: R18.1 31.38,22.49 32.59,21.29 32.59,12.62 33.76,11.46 36.63,11.46 43.2,4.88 43.2,1.93 JP2.5
  Bottom 0.305: v27.66,28.4 27.66,34.27 v26.36,35.56
VCC  (via drill 0.3)
  Top 0.406: IC1.6 17.14,66.57 v15.57,68.15
  Bottom 0.406: C17.1 v23.5,33.91 | C15.1 v14.61,33.91 | C18.1 v32.38,33.91 | C20.1 v41.27,33.91 | C6.1 v50.16,33.91 | C8.1 v58.8,33.91 | C10.1 v67.94,33.91 | C12.1 v76.83,33.91 | C14.1 v85.72,33.91 | C16.1 v96.72,33.91
  pour Top (rank 2): 98.55,0.25 0.25,0.25 0.25,74.93 98.55,74.93
ZERO  (via drill 0.3)
  Top 0.305: IC1.12 v18.41,50.6 | v9.53,50.6 IC22.2 | IC23.2 v3.81,28.07
  Bottom 0.305: v18.41,50.6 v9.53,50.6 4.19,50.6 1.29,47.7 1.29,30.58 v3.81,28.07
ZERO_N
  Top 0.305: IC22.4 8.57,31.96 9.86,30.68 9.86,26.66 R10.1 R20.1
  Top 0.406: R20.1 13.17,22.49 14.25,21.41 14.25,8.87 15.93,7.19 34.44,7.19 38.12,3.5 38.12,1.93 JP2.3

### Text on the board
Document: 0 | 1 | 2 | 3 | 4 | 5 | 6 | 7 | 8 | 9 | 0 | 1-9 | Relay Set D / Decode